# Altium schematic sheet Hole3.SchDoc
size A
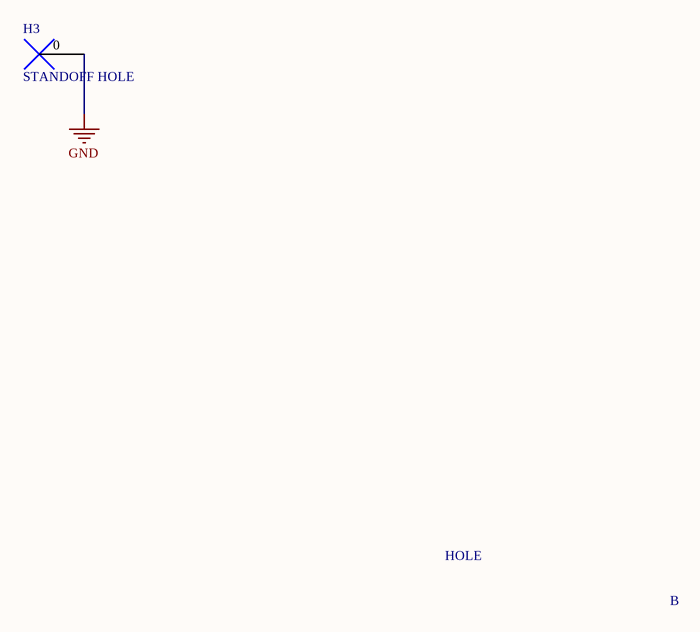
[diagram p0: Hole3.SchDoc]

## Parts
H3  STANDOFF HOLE  [HOLE_3.5MM]

## Nets
GND: H3.0

## Notes on the sheet
- HOLE
- B